# Altium schematic sheet disp7SegTester.SchDoc: DE:TMP:11:UC:EXPANDIDO
size A3; Date: 21-07-2022; SheetNumber: 1; SheetTotal: 1; WebFGR: www.abebashop.com; VersionFGR: 20220721; PageSetup: Record=PageOptions|CenterHorizontal=True|CenterVertical=True|PrintScale=0.94|XCorrection=1.00|YCorrection=1.00|PrintKind=0|BorderSize=5000000|LeftOffset=0|BottomOffset=0|Orientation=2|PaperLength=1000|PaperWidth=1000|Scale=100|PaperSource=7|PrintQuality=-4|MediaType=1|DitherType=10|PaperKind=Letter|PrintScaleMode=1
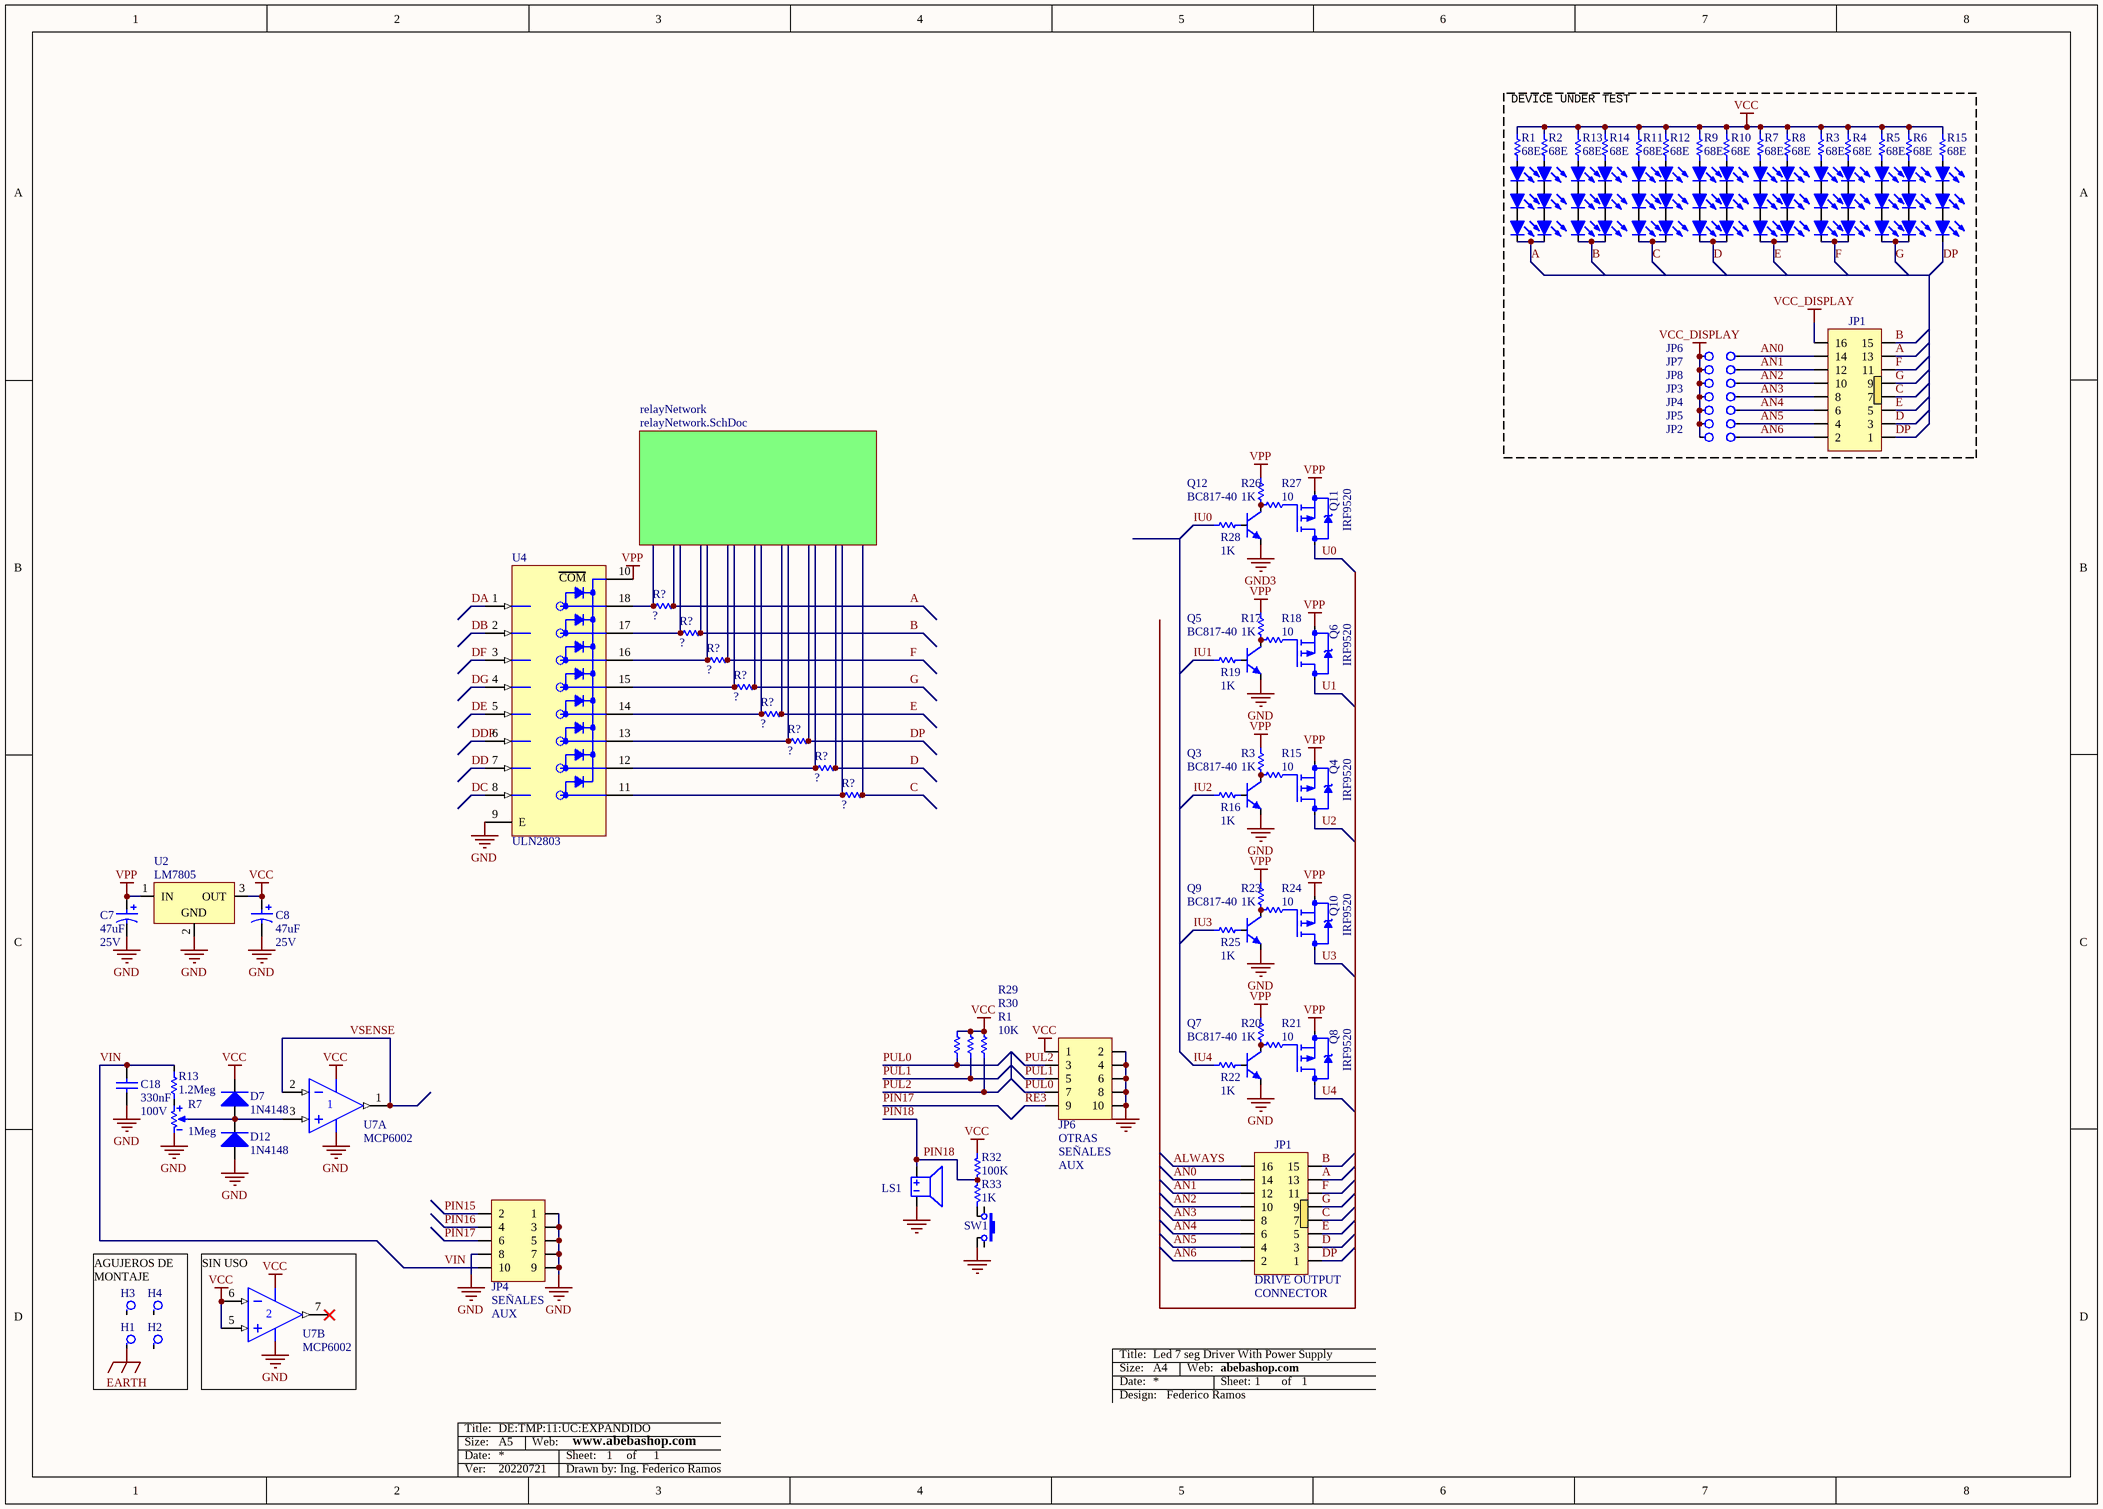
[diagram p0: disp7SegTester.SchDoc]

## Parts
(Parts that share a designator on the sheet are numbered #1, #2 ... from top to bottom, then left to right.)
C7  value 47uF  Voltaje: 25V  [C_EL_6-3X11]  (hidden comment: Cap Pol)
C8  value 47uF  Voltaje: 25V  [C_EL_6-3X11]  (hidden comment: Cap Pol)
C18  value 330nF  Voltage: 100V  [1206NP]  (hidden comment: Cap)
D1  LED  [LED5mm ROJO]  (value not drawn)
D2  LED  [LED5mm ROJO]  (value not drawn)
D3  LED  [LED5mm ROJO]  (value not drawn)
D4  LED  [LED5mm ROJO]  (value not drawn)
D5  LED  [LED5mm ROJO]  (value not drawn)
D6  LED  [LED5mm ROJO]  (value not drawn)
D7#1  LED  [LED5mm ROJO]  (value not drawn)
D7#2  1N4148  [DSMD1MM]
D8  LED  [LED5mm ROJO]  (value not drawn)
D9  LED  [LED5mm ROJO]  (value not drawn)
D10  LED  [LED5mm ROJO]  (value not drawn)
D11  LED  [LED5mm ROJO]  (value not drawn)
D12#1  LED  [LED5mm ROJO]  (value not drawn)
D12#2  1N4148  [DSMD1MM]
D13  LED  [LED5mm ROJO]  (value not drawn)
D14  LED  [LED5mm ROJO]  (value not drawn)
D15  LED  [LED5mm ROJO]  (value not drawn)
D16  LED  [LED5mm ROJO]  (value not drawn)
D17  LED  [LED5mm ROJO]  (value not drawn)
D18  LED  [LED5mm ROJO]  (value not drawn)
D19  LED  [LED5mm ROJO]  (value not drawn)
D20  LED  [LED5mm ROJO]  (value not drawn)
D21  LED  [LED5mm ROJO]  (value not drawn)
D22  LED  [LED5mm ROJO]  (value not drawn)
D23  LED  [LED5mm ROJO]  (value not drawn)
D24  LED  [LED5mm ROJO]  (value not drawn)
D25  LED  [LED5mm ROJO]  (value not drawn)
D26  LED  [LED5mm ROJO]  (value not drawn)
D27  LED  [LED5mm ROJO]  (value not drawn)
D28  LED  [LED5mm ROJO]  (value not drawn)
D29  LED  [LED5mm ROJO]  (value not drawn)
D30  LED  [LED5mm ROJO]  (value not drawn)
D31  LED  [LED5mm ROJO]  (value not drawn)
D32  LED  [LED5mm ROJO]  (value not drawn)
D33  LED  [LED5mm ROJO]  (value not drawn)
D34  LED  [LED5mm ROJO]  (value not drawn)
D35  LED  [LED5mm ROJO]  (value not drawn)
D36  LED  [LED5mm ROJO]  (value not drawn)
D37  LED  [LED5mm ROJO]  (value not drawn)
D38  LED  [LED5mm ROJO]  (value not drawn)
D40  LED  [LED5mm ROJO]  (value not drawn)
D41  LED  [LED5mm ROJO]  (value not drawn)
D42  LED  [LED5mm ROJO]  (value not drawn)
D43  LED  [LED5mm ROJO]  (value not drawn)
D44  LED  [LED5mm ROJO]  (value not drawn)
D45  LED  [LED5mm ROJO]  (value not drawn)
D46  LED  [LED5mm ROJO]  (value not drawn)
H1  Agujero de montaje  [agujero]  (value not drawn)
H2  Agujero de montaje  [agujero]  (value not drawn)
H3  Agujero de montaje  [agujero]  (value not drawn)
H4  Agujero de montaje  [agujero]  (value not drawn)
JP1#1  IDC 8x2 90deg  [idc8x2_90]  (value not drawn)
JP1#2  con: CONNECTOR  drv: DRIVE OUTPUT  [idc8x2_90]  (hidden comment: IDC 8x2 90deg)
JP2  JP  [JUMPER2]  (value not drawn)
JP3  JP  [JUMPER2]  (value not drawn)
JP4#1  JP  [JUMPER2]  (value not drawn)
JP4#2  Price: SEÑALES  [idc5x2]  (hidden comment: IDC 5x2)
JP5  JP  [JUMPER2]  (value not drawn)
JP6#1  JP  [JUMPER2]  (value not drawn)
JP6#2  IDC 5x2  [idc5x2]  (value not drawn)
JP7  JP  [JUMPER2]  (value not drawn)
JP8  JP  [JUMPER2]  (value not drawn)
LS1  Buzzer  [buzzer12mm]  (value not drawn)
Q3  BC817-40  [SOT23]
Q4  IRF9520  [TO220]
Q5  BC817-40  [SOT23]
Q6  IRF9520  [TO220]
Q7  BC817-40  [SOT23]
Q8  IRF9520  [TO220]
Q9  BC817-40  [SOT23]
Q10  IRF9520  [TO220]
Q11  IRF9520  [TO220]
Q12  BC817-40  [SOT23]
R1#1  value 68E  [R1206]  (hidden comment: Res)
R1#2  Resistencia: 10K  [R1206]  (hidden comment: Resistencia 1206; 10Kohm)
R2  value 68E  [R1206]  (hidden comment: Res)
R3#1  value 68E  [R1206]  (hidden comment: Res)
R3#2  Resistencia: 1K  [R1206]  (hidden comment: Resistencia 1206; 1Kohm)
R4  value 68E  [R1206]  (hidden comment: Res)
R5  value 68E  [R1206]  (hidden comment: Res)
R6  value 68E  [R1206]  (hidden comment: Res)
R7#1  value 68E  [R1206]  (hidden comment: Res)
R7#2  value 1Meg  [PRESET]  (hidden comment: Preset)
R8  value 68E  [R1206]  (hidden comment: Res)
R9  value 68E  [R1206]  (hidden comment: Res)
R10  value 68E  [R1206]  (hidden comment: Res)
R11  value 68E  [R1206]  (hidden comment: Res)
R12  value 68E  [R1206]  (hidden comment: Res)
R13#1  value 68E  [R1206]  (hidden comment: Res)
R13#2  value 1.2Meg  [1206NP]  (hidden comment: Res)
R14  value 68E  [R1206]  (hidden comment: Res)
R15#1  value 68E  [R1206]  (hidden comment: Res)
R15#2  Resistencia: 10  [R1206]  (hidden comment: Resistencia 1206; 10ohm)
R16  Resistencia: 1K  [res300th]  (hidden comment: Resistencia 1206; 1Kohm)
R17  Resistencia: 1K  [R1206]  (hidden comment: Resistencia 1206; 1Kohm)
R18  Resistencia: 10  [R1206]  (hidden comment: Resistencia 1206; 10ohm)
R19  Resistencia: 1K  [res300th]  (hidden comment: Resistencia 1206; 1Kohm)
R20  Resistencia: 1K  [R1206]  (hidden comment: Resistencia 1206; 1Kohm)
R21  Resistencia: 10  [R1206]  (hidden comment: Resistencia 1206; 10ohm)
R22  Resistencia: 1K  [res300th]  (hidden comment: Resistencia 1206; 1Kohm)
R23  Resistencia: 1K  [R1206]  (hidden comment: Resistencia 1206; 1Kohm)
R24  Resistencia: 10  [R1206]  (hidden comment: Resistencia 1206; 10ohm)
R25  Resistencia: 1K  [res300th]  (hidden comment: Resistencia 1206; 1Kohm)
R26  Resistencia: 1K  [R1206]  (hidden comment: Resistencia 1206; 1Kohm)
R27  Resistencia: 10  [R1206]  (hidden comment: Resistencia 1206; 10ohm)
R28  Resistencia: 1K  [res300th]  (hidden comment: Resistencia 1206; 1Kohm)
R29  Resistencia 1206; 10Kohm  [R1206]  (value not drawn)
R30  Resistencia 1206; 10Kohm  [R1206]  (value not drawn)
R32  Resistencia: 100K  [R1206]  (hidden comment: Resistencia 1206; 10Kohm)
R33  Resistencia: 1K  [R1206]  (hidden comment: Resistencia 1206; 10Kohm)
R?#1  Res  [R1206]  (value not drawn)
R?#2  Res  [R1206]  (value not drawn)
R?#3  Res  [R1206]  (value not drawn)
R?#4  Res  [R1206]  (value not drawn)
R?#5  Res  [R1206]  (value not drawn)
R?#6  Res  [R1206]  (value not drawn)
R?#7  Res  [R1206]  (value not drawn)
R?#8  Res  [R1206]  (value not drawn)
ROT?  ROTULO  (value not drawn)  (graphical)
SW1  SW_T_5MM  [SW_T_5MM]  (value not drawn)
U2  LM7805  [TO220]
U4  ULN2803  [DIP18Z]
U7  MCP6002  [dip8z]  (parts A,B of 2)

## Blocks framed on the sheet
DEVICE UNDER TEST: D1-D6 D7#1 D8-D11 D12#1 D13-D38 D40-D46 JP1#1 JP2 JP3 JP4#1 JP5 JP6#1 JP7 JP8 R1#1 R2 R3#1 R4-R6 R7#1 R8-R12 R13#1 R14 R15#1

## Sub-sheets
relayNetwork = relayNetwork.SchDoc: no entries

## Nets
EARTH: H1.1
GND: C7.2 C8.2 C18.1 D12#2.1 JP4#2.1 JP4#2.3 JP4#2.5 JP4#2.7 JP4#2.8 JP4#2.9 JP6#2.2 JP6#2.4 JP6#2.6 JP6#2.8 JP6#2.10 LS1.2 Q3.2(E) Q5.2(E) Q7.2(E) Q9.2(E) R7#2.3 SW1.2 U2.2(GND) U4.9(E) U7.4(V-)
GND3: Q12.2(E)
VCC: C8.1 D7#2.2 JP6#2.1 R1#1.2 R1#2.2 R2.2 R3#1.2 R4.2 R5.2 R6.2 R7#1.2 R8.2 R9.2 R10.2 R11.2 R12.2 R13#1.2 R14.2 R15#1.2 R29.2 R30.2 R32.2 U2.3(OUT) U7.5(IN+) U7.6(IN-) U7.8(V+)
VCC_DISPLAY: JP1#1.16 JP2.2 JP3.2 JP4#1.2 JP5.2 JP6#1.2 JP7.2 JP8.2
VPP: C7.1 Q4.3(S) Q6.3(S) Q8.3(S) Q10.3(S) Q11.3(S) R3#2.2 R17.2 R20.2 R23.2 R26.2 U2.1(IN) U4.10(~{COM})
A: D16.2(K) D40.2(K) JP1#1.13 JP1#2.13 R?#1.1
ALWAYS: JP1#2.16
AN0: JP1#1.14 JP1#2.14 JP6#1.1
AN1: JP1#1.12 JP1#2.12 JP7.1
AN2: JP1#1.10 JP1#2.10 JP8.1
AN3: JP1#1.8 JP1#2.8 JP3.1
AN4: JP1#1.6 JP1#2.6 JP4#1.1
AN5: JP1#1.4 JP1#2.4 JP5.1
AN6: JP1#1.2 JP1#2.2 JP2.1
B: D22.2(K) D46.2(K) JP1#1.15 JP1#2.15 R?#2.1
C: D21.2(K) D45.2(K) JP1#1.7 JP1#2.7 R?#8.1
D: D20.2(K) D44.2(K) JP1#1.3 JP1#2.3 R?#7.1
DA: U4.1(B1)
DB: U4.2(B2)
DC: U4.8(B8)
DD: U4.7(B7)
DDP: U4.6(B6)
DE: U4.5(B5)
DF: U4.3(B3)
DG: U4.4(B4)
DP: D31.2(K) JP1#1.1 JP1#2.1 R?#6.1
E: D19.2(K) D43.2(K) JP1#1.5 JP1#2.5 R?#5.1
F: D17.2(K) D41.2(K) JP1#1.11 JP1#2.11 R?#3.1
G: D18.2(K) D42.2(K) JP1#1.9 JP1#2.9 R?#4.1
IU0: R28.1
IU1: R19.1
IU2: R16.1
IU3: R25.1
IU4: R22.1
PIN15: JP4#2.2
PIN16: JP4#2.4
PIN17: JP4#2.6
PIN18: LS1.1 R32.1 R33.2
PUL0: JP6#2.7 R29.1
PUL1: JP6#2.5 R30.1
PUL2: JP6#2.3 R1#2.1
RE3: JP6#2.9
U0: Q11.2(D)
U1: Q6.2(D)
U2: Q4.2(D)
U3: Q10.2(D)
U4: Q8.2(D)
VIN: C18.2 JP4#2.10 R13#2.2
VSENSE: U7.1(OUT) U7.2(IN-)
NetD1_1: D1.1(A) R2.1
NetD1_2: D1.2(K) D8.1(A)
NetD2_1: D2.1(A) R4.1
NetD2_2: D2.2(K) D9.1(A)
NetD3_1: D3.1(A) R6.1
NetD3_2: D3.2(K) D10.1(A)
NetD4_1: D4.1(A) R8.1
NetD4_2: D4.2(K) D11.1(A)
NetD5_1: D5.1(A) R10.1
NetD5_2: D5.2(K) D12#1.1(A)
NetD6_1: D6.1(A) R12.1
NetD6_2: D6.2(K) D13.1(A)
NetD7#1_1: D7#1.1(A) R14.1
NetD7#1_2: D7#1.2(K) D14.1(A)
NetD7#2_1: D7#2.1 D12#2.2 R7#2.2 U7.3(IN+)
NetD8_2: D8.2(K) D16.1(A)
NetD9_2: D9.2(K) D17.1(A)
NetD10_2: D10.2(K) D18.1(A)
NetD11_2: D11.2(K) D19.1(A)
NetD12#1_2: D12#1.2(K) D20.1(A)
NetD13_2: D13.2(K) D21.1(A)
NetD14_2: D14.2(K) D22.1(A)
NetD15_1: D15.1(A) R15#1.1
NetD15_2: D15.2(K) D23.1(A)
NetD23_2: D23.2(K) D31.1(A)
NetD24_1: D24.1(A) R1#1.1
NetD24_2: D24.2(K) D32.1(A)
NetD25_1: D25.1(A) R3#1.1
NetD25_2: D25.2(K) D33.1(A)
NetD26_1: D26.1(A) R5.1
NetD26_2: D26.2(K) D34.1(A)
NetD27_1: D27.1(A) R7#1.1
NetD27_2: D27.2(K) D35.1(A)
NetD28_1: D28.1(A) R9.1
NetD28_2: D28.2(K) D36.1(A)
NetD29_1: D29.1(A) R11.1
NetD29_2: D29.2(K) D37.1(A)
NetD30_1: D30.1(A) R13#1.1
NetD30_2: D30.2(K) D38.1(A)
NetD32_2: D32.2(K) D40.1(A)
NetD33_2: D33.2(K) D41.1(A)
NetD34_2: D34.2(K) D42.1(A)
NetD35_2: D35.2(K) D43.1(A)
NetD36_2: D36.2(K) D44.1(A)
NetD37_2: D37.2(K) D45.1(A)
NetD38_2: D38.2(K) D46.1(A)
NetQ3_1: Q3.1(B) R16.2
NetQ3_3: Q3.3(C) R3#2.1 R15#2.1
NetQ4_1: Q4.1(G) R15#2.2
NetQ5_1: Q5.1(B) R19.2
NetQ5_3: Q5.3(C) R17.1 R18.1
NetQ6_1: Q6.1(G) R18.2
NetQ7_1: Q7.1(B) R22.2
NetQ7_3: Q7.3(C) R20.1 R21.1
NetQ8_1: Q8.1(G) R21.2
NetQ9_1: Q9.1(B) R25.2
NetQ9_3: Q9.3(C) R23.1 R24.1
NetQ10_1: Q10.1(G) R24.2
NetQ11_1: Q11.1(G) R27.2
NetQ12_1: Q12.1(B) R28.2
NetQ12_3: Q12.3(C) R26.1 R27.1
NetR7#2_1: R7#2.1 R13#2.1
NetR33_1: R33.1 SW1.1
NetR?#1_2: R?#1.2 U4.18(~{C}1)
NetR?#2_2: R?#2.2 U4.17(~{C}2)
NetR?#3_2: R?#3.2 U4.16(~{C}3)
NetR?#4_2: R?#4.2 U4.15(~{C}4)
NetR?#5_2: R?#5.2 U4.14(~{C}5)
NetR?#6_2: R?#6.2 U4.13(~{C}6)
NetR?#7_2: R?#7.2 U4.12(~{C}7)
NetR?#8_2: R?#8.2 U4.11(~{C}8)

Not connected (* = marked no-connect by the designer): H2 1; H3 1; H4 1; SW1 3 4; U7 7(OUT)*

## Notes on the sheet
- AGUJEROS DE MONTAJE
- (near U7) SIN USO
- (near ROT?) Led 7 seg Driver With Power Supply
- Federico Ramos
- abebashop.com
- 1
- Title:
- Size:
- Date:
- A5
- Web:
- Sheet:
- of
- Ver:
- Drawn by: Ing. Federico Ramos
- (in symbol IDC 5x2) AUX; OTRAS; SEÑALES
- (in symbol ROTULO) Title:; Size:; A4; Web:; Date:; Sheet:; of; Design:
- (in symbol ULN2803) COM

## Library data of the parts
C7 C8 = Cap Pol: Capacitor Polarizado; Price: ?
C18 = Cap: Capacitor; Price: 0.25; Technology: Ceramic
D7#2 D12#2 = 1N4148: High Conductance Fast Diode; Price: ?
JP1#2 = IDC 8x2 90deg: outout: OUTPUT; Price: ?
JP2 JP3 JP4#1 JP5 JP6#1 JP7 JP8 = JP: Jumper 2 contactos; Price: ?
Q3 Q5 Q7 Q9 Q12 = BC817-40: Dolares Elemon: 0.03755; Codigo Elemon: TR1723021
Q4 Q6 Q8 Q10 Q11 = IRF9530: 100V  12A 0.3 ohm Power Field Effect Transistor; Revision: 17-Jul-2002: Re-released for DXP Platform.
R1#1 R2 R3#1 R4-R6 R7#1 R8-R12 R13#1 R13#2 R14 R15#1 = Res: Resistor; Power: 0.25W; Price: 0.036
R1#2 R32 R33 = Resistencia 1206; 10Kohm: Codigo Elemon: RS3886245; Dolares Elemon: 0.00718
R3#2 R16 R17 R19 R20 R22 R23 R25 R26 R28 = Resistencia 1206; 1Kohm: Codigo Elemon: RS3886185; Dolares Elemon: 0.00720
R7#2 = Preset: Resistencia Variable
R15#2 R18 R21 R24 R27 = Resistencia 1206; 10ohm: Codigo Elemon: RS3886070; Dolares Elemon: 0.00717
R29 R30 = Resistencia 1206; 10Kohm: Codigo Elemon: RS3886245; Dolares Elemon: 0.00718; Resistencia: 10K
R?#1-R?#8 = Res: Resistencia; Power: 0.25W; Price: 0.036; Value: ?
U2 = LM78XX (v1): 3-Terminal Positive Regulator; Price: ?
U4 = ULN2803: Darlington Transistor Array; Price: 1.40
U7 = MCP6002: 1 MHz Bandwidth Low Power Op Amp
D1-D6 D7#1 D8-D11 D12#1 D13-D38 D40-D46 = LED: Price: ?
JP1#1 = IDC 8x2 90deg: Price: ?
JP4#2 JP6#2 = IDC 5x2
  JP6#2: Price: ?
LS1 = Buzzer: Price: ?
SW1 = SW_T_5MM: Price: ?